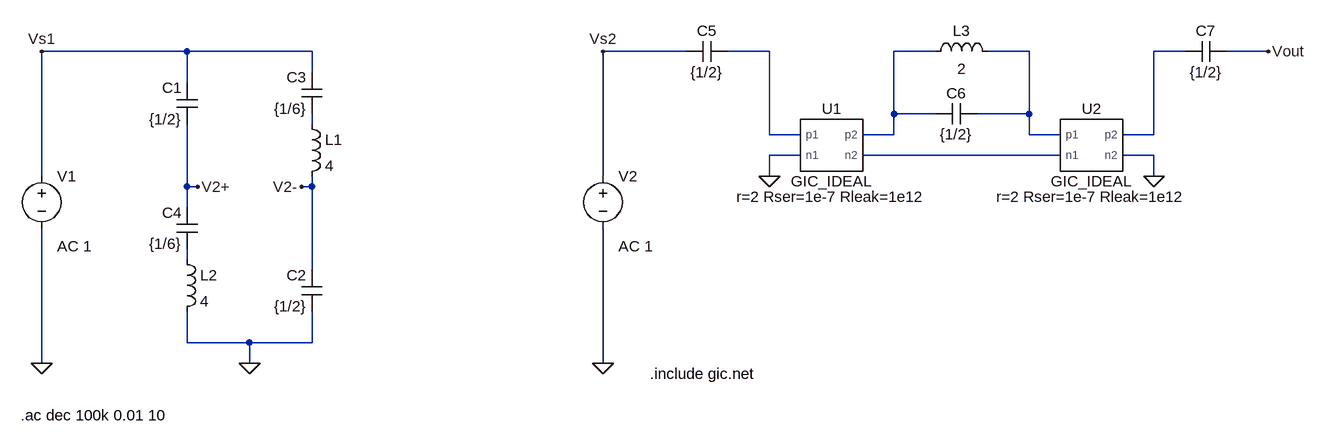
[diagram p0: schematic TS7_2.asc]
TS7_2.asc, the LTspice schematic file:
Version 4
SHEET 1 1332 680
WIRE -576 -32 -800 -32
WIRE -384 -32 -576 -32
WIRE 192 -32 64 -32
WIRE 320 -32 256 -32
WIRE 576 -32 512 -32
WIRE 720 -32 656 -32
WIRE 960 -32 912 -32
WIRE 1088 -32 1024 -32
WIRE -384 0 -384 -32
WIRE -576 16 -576 -32
WIRE 512 64 512 -32
WIRE 576 64 512 64
WIRE 720 64 720 -32
WIRE 720 64 640 64
WIRE -384 80 -384 64
WIRE 320 96 320 -32
WIRE 368 96 320 96
WIRE 512 96 512 64
WIRE 512 96 464 96
WIRE 720 96 720 64
WIRE 768 96 720 96
WIRE 912 96 912 -32
WIRE 912 96 864 96
WIRE 368 128 320 128
WIRE 768 128 464 128
WIRE 912 128 864 128
WIRE -800 160 -800 -32
WIRE 64 160 64 -32
WIRE 320 160 320 128
WIRE 912 160 912 128
WIRE -576 176 -576 80
WIRE -560 176 -576 176
WIRE -384 176 -384 160
WIRE -384 176 -400 176
WIRE -576 208 -576 176
WIRE -576 288 -576 272
WIRE -384 304 -384 176
WIRE -576 416 -576 368
WIRE -480 416 -576 416
WIRE -384 416 -384 368
WIRE -384 416 -480 416
WIRE -800 448 -800 240
WIRE -480 448 -480 416
WIRE 64 448 64 240
FLAG -800 448 0
FLAG -800 -32 Vs1
FLAG -480 448 0
FLAG -560 176 V2+
FLAG -400 176 V2-
FLAG 64 448 0
FLAG 64 -32 Vs2
FLAG 320 160 0
FLAG 912 160 0
FLAG 1088 -32 Vout
SYMBOL voltage -800 144 R0
WINDOW 123 24 124 Left 2
WINDOW 39 24 152 Left 2
SYMATTR InstName V1
SYMATTR Value ""
SYMATTR Value2 AC 1
SYMBOL cap -560 80 R180
WINDOW 0 24 56 Left 2
WINDOW 3 24 8 Left 2
SYMATTR InstName C1
SYMATTR Value {1/2}
SYMBOL cap -368 368 R180
WINDOW 0 24 56 Left 2
WINDOW 3 24 8 Left 2
SYMATTR InstName C2
SYMATTR Value {1/2}
SYMBOL cap -368 64 R180
WINDOW 0 24 56 Left 2
WINDOW 3 24 8 Left 2
SYMATTR InstName C3
SYMATTR Value {1/6}
SYMBOL ind -400 64 R0
SYMATTR InstName L1
SYMATTR Value 4
SYMBOL cap -560 272 R180
WINDOW 0 24 56 Left 2
WINDOW 3 24 8 Left 2
SYMATTR InstName C4
SYMATTR Value {1/6}
SYMBOL ind -592 272 R0
SYMATTR InstName L2
SYMATTR Value 4
SYMBOL voltage 64 144 R0
WINDOW 123 24 124 Left 2
WINDOW 39 24 152 Left 2
SYMATTR InstName V2
SYMATTR Value ""
SYMATTR Value2 AC 1
SYMBOL cap 192 -16 R270
WINDOW 0 32 32 VTop 2
WINDOW 3 0 32 VBottom 2
SYMATTR InstName C5
SYMATTR Value {1/2}
SYMBOL cap 576 80 R270
WINDOW 0 32 32 VTop 2
WINDOW 3 0 32 VBottom 2
SYMATTR InstName C6
SYMATTR Value {1/2}
SYMBOL ind 560 -16 R270
WINDOW 0 32 56 VTop 2
WINDOW 3 5 56 VBottom 2
SYMATTR InstName L3
SYMATTR Value 2
SYMBOL cap 960 -16 R270
WINDOW 0 32 32 VTop 2
WINDOW 3 0 32 VBottom 2
SYMATTR InstName C7
SYMATTR Value {1/2}
SYMBOL GIC_IDEAL 416 112 R0
SYMATTR InstName U1
SYMATTR SpiceLine r=2 Rser=1e-7 Rleak=1e12
SYMBOL GIC_IDEAL 816 112 R0
SYMATTR InstName U2
SYMATTR SpiceLine r=2 Rser=1e-7 Rleak=1e12
TEXT -832 528 Left 2 !.ac dec 100k 0.01 10
TEXT 136 464 Left 2 !.include gic.net

The netlist it stands for:
* TS7_2.asc
V1 Vs1 0 AC 1
C1 V2+ Vs1 {1/2}
C2 0 V2- {1/2}
C3 N005 Vs1 {1/6}
L1 N005 V2- 4
C4 N007 V2+ {1/6}
L2 N007 0 4
V2 Vs2 0 AC 1
C5 Vs2 N001 {1/2}
C6 N002 N003 {1/2}
L3 N002 N003 2
C7 N004 Vout {1/2}
XU1 N001 0 N002 N006 GIC_IDEAL r=2 Rser=1e-7 Rleak=1e12  ; pins p1 n1 p2 n2
XU2 N003 N006 N004 0 GIC_IDEAL r=2 Rser=1e-7 Rleak=1e12  ; pins p1 n1 p2 n2
.ac dec 100k 0.01 10
.include gic.net
.backanno
.end